# Altium schematic sheet TDS_sensor.SchDoc
size A4; SheetNumber: 6; SheetTotal: 7
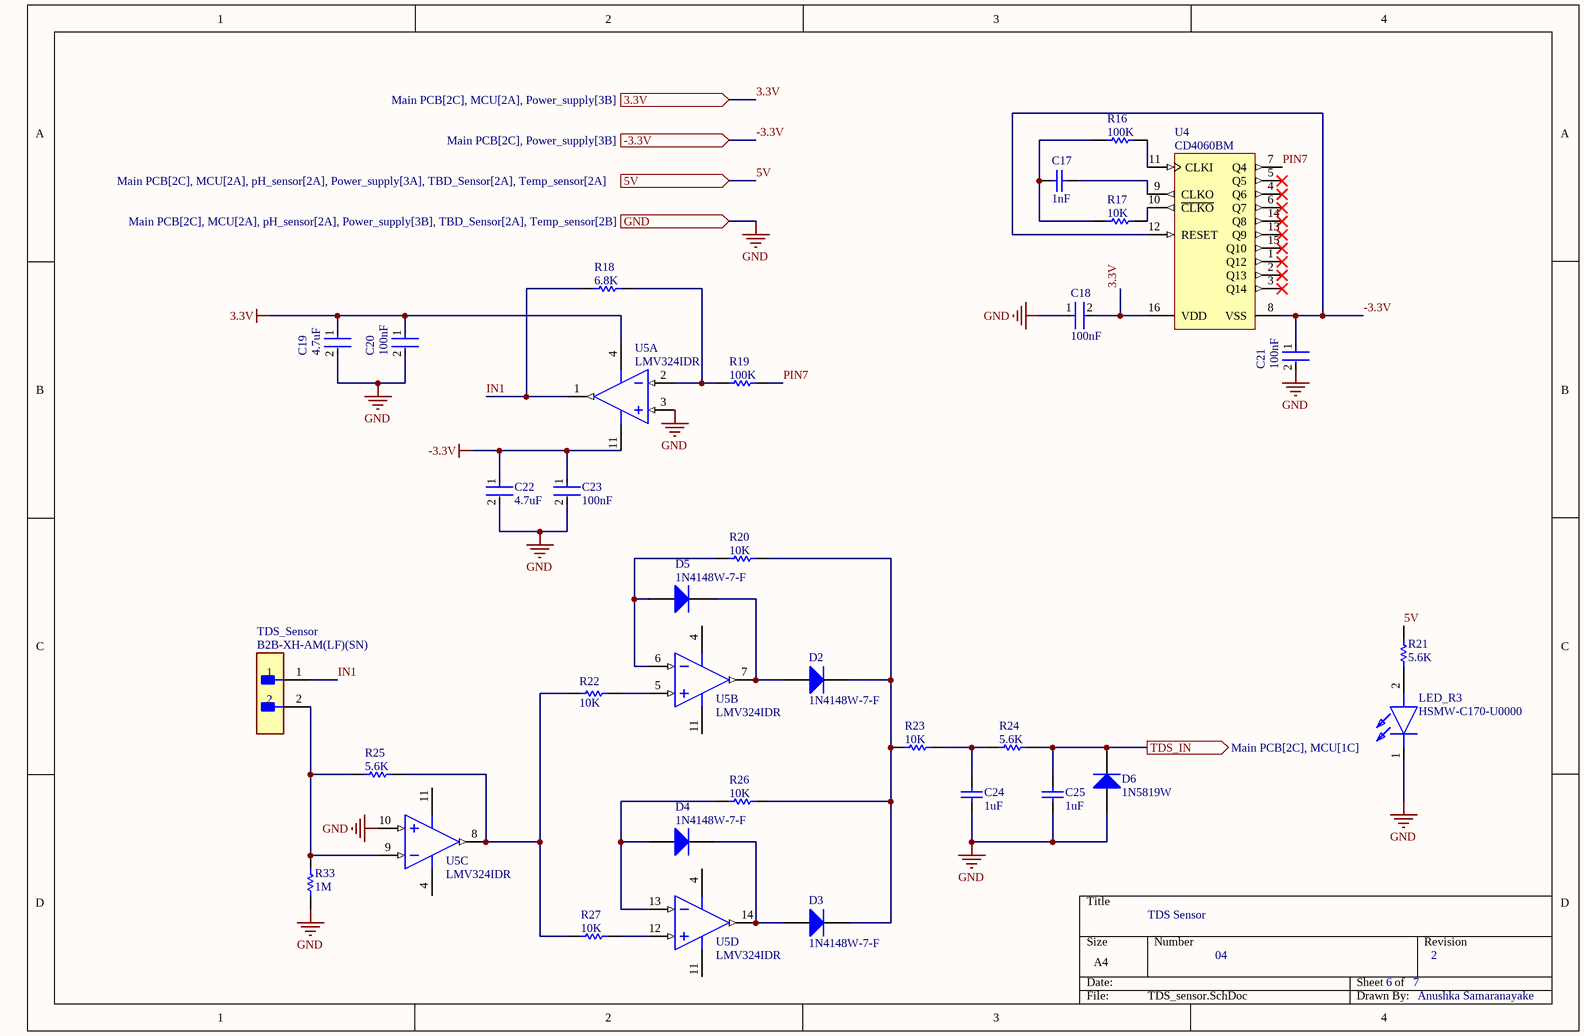
[diagram p0: TDS_sensor.SchDoc]

## Parts
C17  1nF  [CAPC2013X135X50LL15T20]
C18  100nF  [FP-CL31-IPC_B]
C19  4.7uF  [FP-CL31-IPC_B]
C20  100nF  [FP-CL31-IPC_B]
C21  100nF  [FP-CL31-IPC_B]
C22  4.7uF  [FP-CL31-IPC_B]
C23  100nF  [FP-CL31-IPC_B]
C24  1uF  [CAPC2013X135X50LL15T20]
C25  1uF  [CAPC2013X135X50LL15T20]
D2  1N4148W-7-F  [DIOD-SOD123-2_V]
D3  1N4148W-7-F  [DIOD-SOD123-2_V]
D4  1N4148W-7-F  [DIOD-SOD123-2_V]
D5  1N4148W-7-F  [DIOD-SOD123-2_V]
D6  1N5819W  [DIOD-SOD123-2_V]
LED_R3  HSMW-C170-U0000  [LEDC2012X90N]
R16  100K  [RESC3216X70X50LL20T25]
R17  10K  [RESC3216X70X50LL20T25]
R18  6.8K  [RESC3216X70X50LL20T25]
R19  100K  [RESC3216X70X50LL20T25]
R20  10K  [RESC3216X70X50LL20T25]
R21  5.6K  [RESC3216X70X50LL20T25]
R22  10K  [RESC3216X70X50LL20T25]
R23  10K  [RESC3216X70X50LL20T25]
R24  5.6K  [RESC3216X70X50LL20T25]
R25  5.6K  [RESC3216X70X50LL20T25]
R26  10K  [RESC3216X70X50LL20T25]
R27  10K  [RESC3216X70X50LL20T25]
R33  1M  [RESC3216X70X50LL20T25]
TDS_Sensor  B2B-XH-AM(LF)(SN)  [FP-B2B-XH-AM_LF_SN-MFG]
U4  CD4060BM  [D0016A_M]
U5  LMV324IDR  [D0014A_V]  (parts A,B,C,D of 4)

## Ports
3.3V (in, see Main PCB[2C], MCU[2A], Power_supply[3B]), 5V (in, see Main PCB[2C], MCU[2A], pH_sensor[2A], Power_supply[3A], TBD_Sensor[2A], Temp_sensor[2A]), -3.3V (in, see Main PCB[2C], Power_supply[3B]), GND (in, see Main PCB[2C], MCU[2A], pH_sensor[2A], Power_supply[3B], TBD_Sensor[2A], Temp_sensor[2B]), TDS_IN (out, see Main PCB[2C], MCU[1C])

## Nets
3.3V: C18.2 C19.1 C20.1 U4.16(VDD) U5.4(VCC+) ; port 3.3V
-3.3V: C21.1 C22.1 C23.1 U4.8(VSS) U4.12(RESET) U5.11(GND) ; port -3.3V
GND: C18.1 C19.2 C20.2 C21.2 C22.2 C23.2 C24.1 C25.1 D6.1(A) LED_R3.1(K) R33.2 U5.3(1IN+) U5.10(3IN+) ; port GND
5V: R21.1 ; port 5V
IN1: R18.2 TDS_Sensor.1 U5.1(1OUT)
PIN7: R19.1 U4.7(Q4)
TDS_IN: C25.2 D6.2(K) R24.1 ; port TDS_IN
NetC17_1: C17.1 R16.2 R17.2
NetC17_2: C17.2 U4.9(CLKO)
NetC24_2: C24.2 R23.1 R24.2
NetD2_1: D2.1(A) D5.2(K) U5.7(2OUT)
NetD2_2: D2.2(K) D3.2(K) R20.1 R23.2 R26.1
NetD3_1: D3.1(A) D4.2(K) U5.14(4OUT)
NetD4_1: D4.1(A) R26.2 U5.13(4IN-)
NetD5_1: D5.1(A) R20.2 U5.6(2IN-)
NetLED_R3_2: LED_R3.2(A) R21.2
NetR16_1: R16.1 U4.11(CLKI)
NetR17_1: R17.1 U4.10(~{CLKO})
NetR18_1: R18.1 R19.2 U5.2(1IN-)
NetR22_1: R22.1 U5.5(2IN+)
NetR22_2: R22.2 R25.1 R27.2 U5.8(3OUT)
NetR25_2: R25.2 R33.1 TDS_Sensor.2 U5.9(3IN-)
NetR27_1: R27.1 U5.12(4IN+)

Not connected (* = marked no-connect by the designer): U4 1(Q12)* 2(Q13)* 3(Q14)* 4(Q6)* 5(Q5)* 6(Q7)* 13(Q9)* 14(Q8)* 15(Q10)*

## Notes on the sheet
- TDS Sensor
- 04
- 6
- 7
- 2
- Anushka Samaranayake

## Library data of the parts
C17 C24 C25 = CMP-2007-03437-1: Manufacturer: Vitramon; Part Number: VJ0805Y102KXACW1BC
C18-C23 = CMP-13271-001731-1: Cap Ceramic 100nF 50V X7R ±10% SMD 1206 +125°C Embossed T/R; Voltage: 50V; Thickness: 0.037inch; Lead Free: Lead Free; Length: 3.2mm; Min Operating Temperature: -55°C; Package Quantity: 15000; Packaging: Tape and Reel; Mount: Surface Mount; Depth: 1.6mm; Case/Package: 1206; Voltage Rating (DC): 50V; Tolerance: 10%; Height: 0.85mm; Capacitance: 100nF; Radiation Hardening: No; Dielectric: X7R; Voltage Rating: 50V; Max Operating Temperature: 125°C; Width: 0.063inch
D2-D6 = CMP-2000-04932-2: Fast Switching Diode, 100 V, 0.15 A, -65 to 150 degC, 2-Pin?SOD123, RoHS, Tape and Reel; Recovery Time: 4ns; Brand: DiodesIncorporated; Unit Weight: 0.000353oz; Max Surge Current: 2A; Peak Reverse Voltage: 100V; Ir - Reverse Current: 1uA; Vf - Forward Voltage: 1.25V; Configuration: Single; If - Forward Current: 0.15A; Product Category: Diodes-GeneralPurpose,Power,Switching; Operating Temperature Range: -65Cto+150C; Packaging: Reel; Manufacturer URL: http://www.diodes.com/; Maximum Operating Temperature: +150C; Height: 1.25mm; Minimum Operating Temperature: -65C; Product: SwitchingDiodes; Package URL: http://www.diodes.com/datasheets/ds18004.pdf; Type: SwitchingDiode; Package Reference: SOD123-2; Width: 1.7mm; Datasheet URL: http://www.farnell.com/datasheets/1915529.pdf; Datasheet Version: Rev. 24-2, 10/2013; Series: 1N4148; Factory Pack Quantity: 3000; Length: 2.85mm; RoHS: True; Manufacturer: DiodesIncorporated; Mounting Style: SMD/SMT; Package / Case: SOD-123
LED_R3 = HSMW-C170-U0000: LED; Manufacturer_Name: Avago Technologies; Datasheet Link: https://componentsearchengine.com/Datasheets/2/HSMW-C170-U0000.pdf; Height: 0.9mm; Manufacturer_Part_Number: HSMW-C170-U0000; Mouser Part Number: 630-HSMW-C170-U0000; Mouser Price/Stock: https://www.mouser.co.uk/ProductDetail/Broadcom-Avago/HSMW-C170-U0000?qs=tMOYG%252Bw4%252BLwGyeHODzQdug%3D%3D
R16-R27 R33 = CMP-2003-04407-1: Manufacturer: Panasonic; Part Number: ERA8AEB103V
TDS_Sensor = CMP-17439-000037-1: CONN HEADER VERT 2POS 2.5MM; Max Voltage Rating (AC): 250V; Connector Type: Male Pin; Contact Resistance: 20mR; Max Current Rating: 3A; Number of Positions: 2; Series: XH; Contact Material: Brass; Mount: Through Hole; Housing Material: Polyamide; Contact Plating: Tin; Termination: Solder; Max Operating Temperature: 85°C; Depth: 5.75mm; Packaging: Bulk; Min Operating Temperature: -25°C; Contact Type: Male Pin; Color: Green; Pitch: 2.5mm; Length: 7.4mm; Lead Free: Lead Free; Number of Rows: 1; Fastening Type: Detent; Housing Color: White; Orientation: Straight
U4 = CMP-1086-00003-4: CMOS 14-Stage Ripple Carry Binary Counter / Divider and Oscillator, 3 to 18 V, -55 to 125 degC, 16-Pin SOIC (D), Green (RoHS & no Sb/Br), Tube; Manufacturer: Texas Instruments; VDD: 3 to 18 V; tPHL, tPLH (typ) @ 5 V: 370 ns; PartNumber: CD4060BM; ComponentLink3Description: Package Specification; ComponentLink1Description: Manufacturer URL; ComponentLink2URL: http://www.ti.com/lit/ds/symlink/cd4060b.pdf; Mounting Technology: Surface Mount; PackageDescription: 16-Pin Plastic Small-Outline Package, Body 9.9 x 3.9 mm, Pitch 1.27 mm; ComponentLink2Description: Datasheet; ComponentLink1URL: http://www.ti.com; PackageReference: D0016A; Temperature Range: -55 to 125 degC; ComponentLink3URL: http://www.ti.com/lit/ml/mpds178g/mpds178g.pdf; PackageVersion: 4040047-6/M; Note1: Green (RoHS & no Sb/Br); Packing: Tube; DatasheetVersion: SCHS049C
U5 = CMP-1685-00010-1: Quad Low-Voltage Rail-to-Rail Output Operational Amplifier, 2.7 to 5.5 V, -40 to 125 degC, 14-Pin SOIC (D), Green (RoHS & no Sb/Br), Tape and Reel; ComponentLink3Description: Package Specification; ComponentLink2URL: http://www.ti.com/lit/ds/symlink/lmv324.pdf; ComponentLink3URL: http://www.ti.com/lit/ml/mpds177g/mpds177g.pdf; DatasheetVersion: SLOS263W, 10/2014; ComponentLink1URL: http://www.ti.com/; Code_JEDEC: MS-012; ComponentLink1Description: Manufacturer URL; PackageDescription: 14-Pin Small Outline Integrated Circuit, Body 8.65 x 3.9 mm, Pitch 1.27 mm; PackageReference: D0014A; ComponentLink2Description: Datasheet